# EAGLE design capsense-soil-sensor (EAGLE 7.4.0)
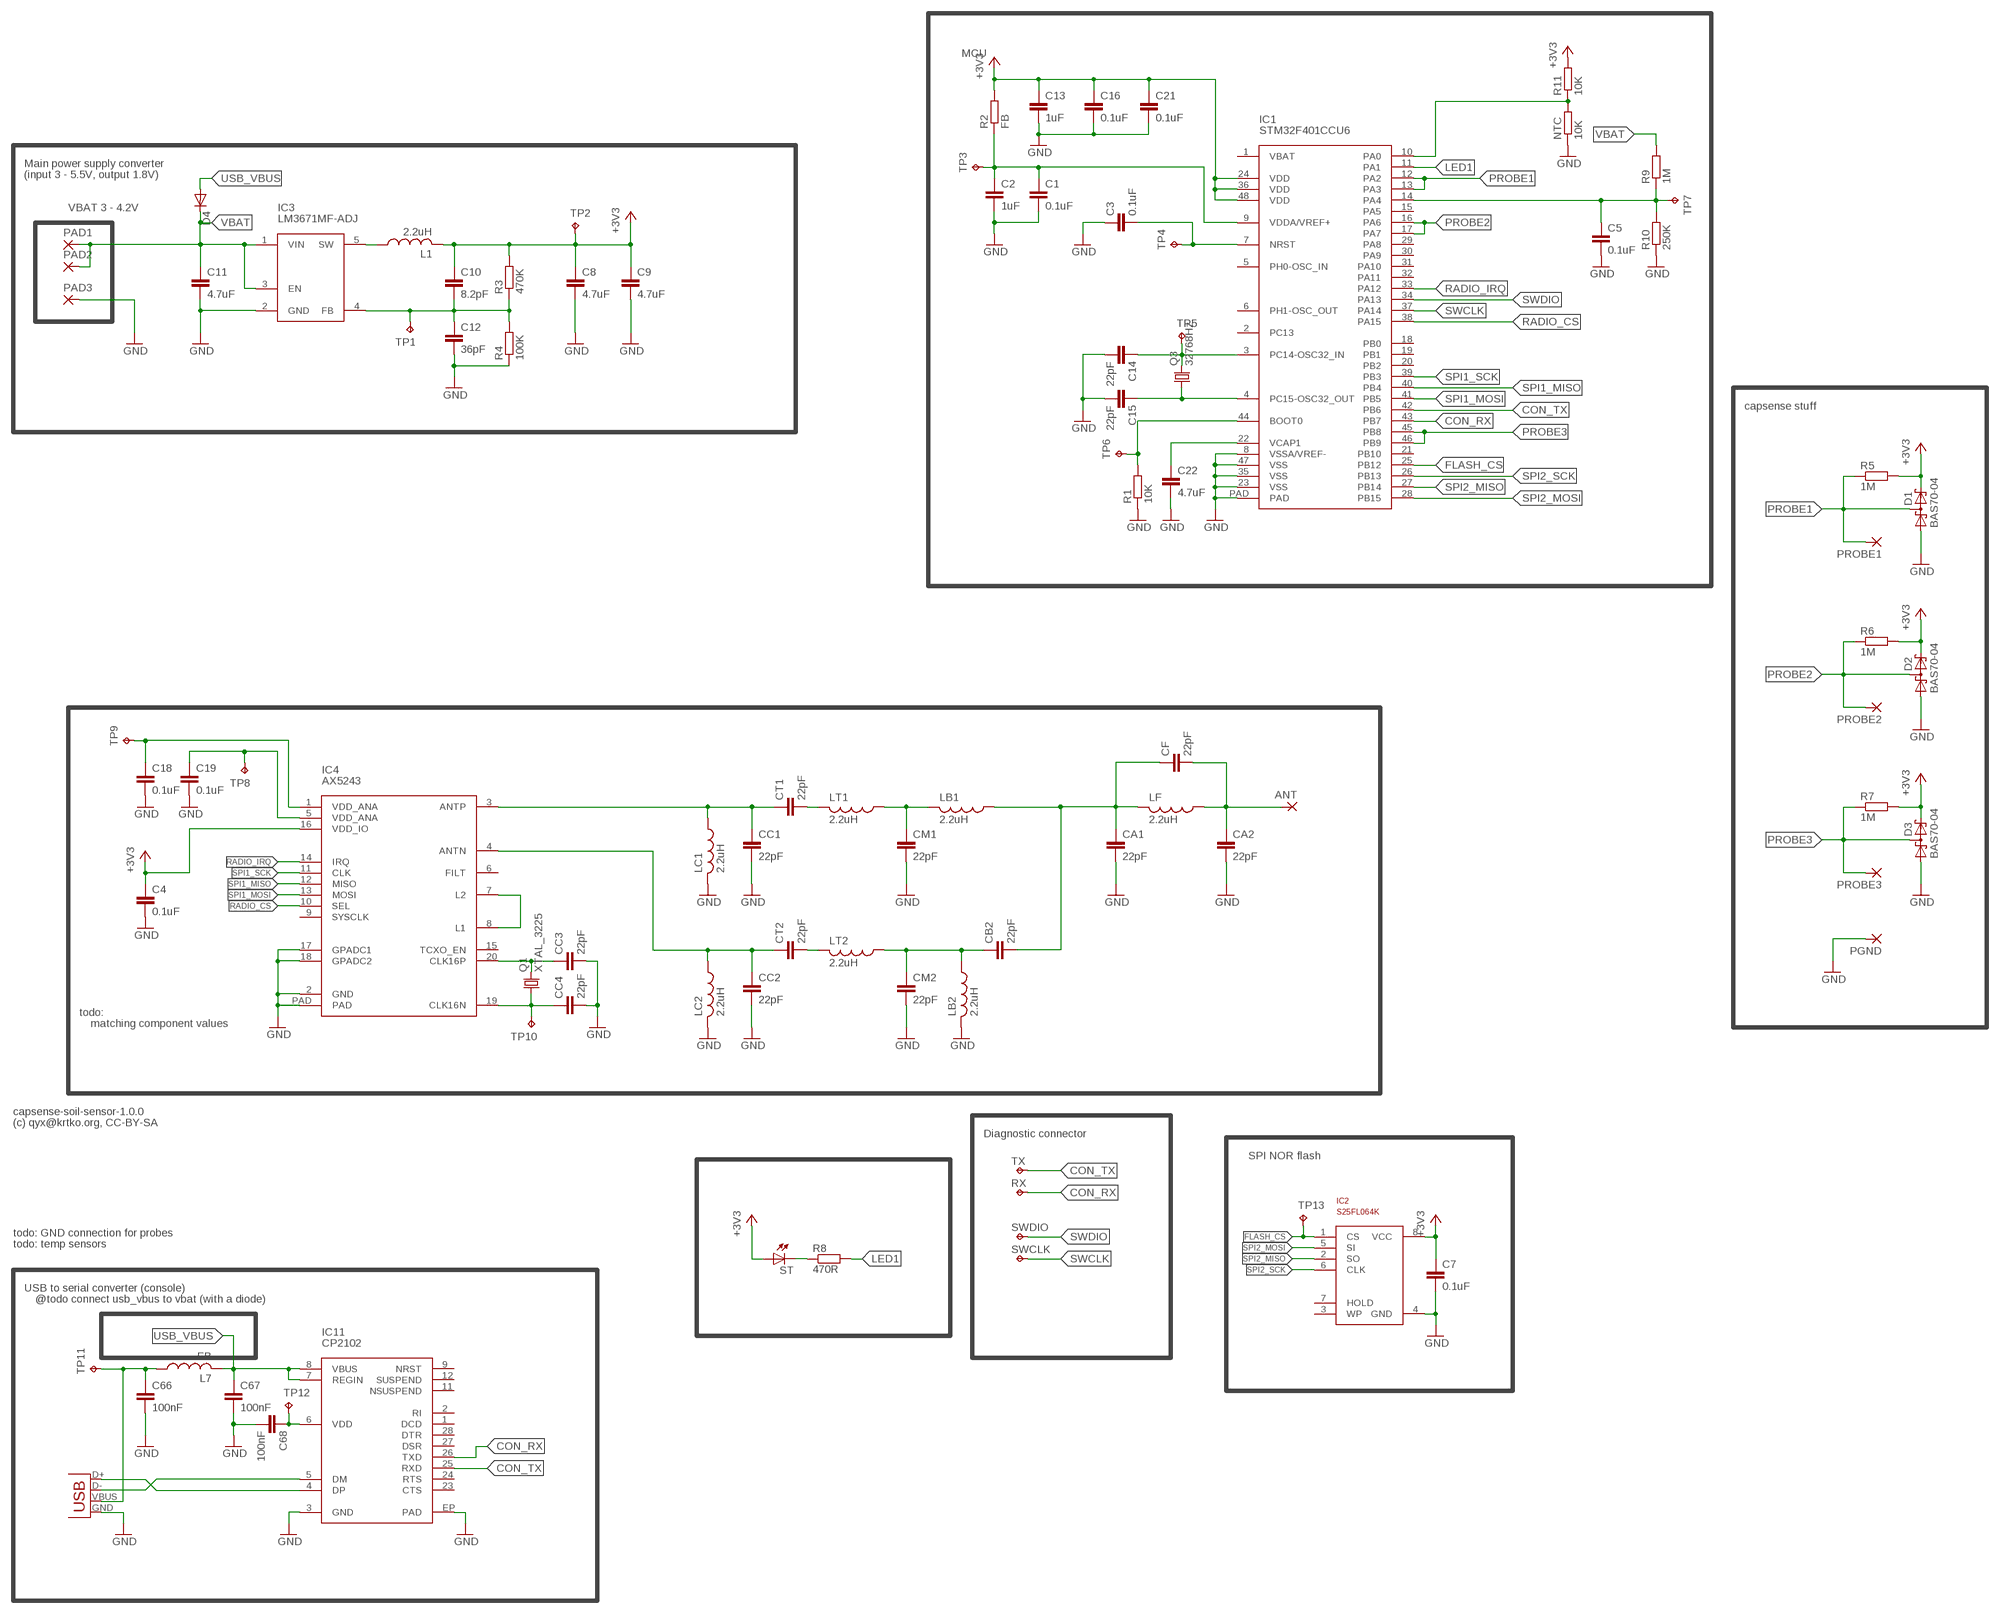
[diagram p0: schematic, sheet 1]

## Parts
ANT  2,15/1,0  [2,15/1,0]
C1  0.1uF  C-EUC0603  [C0603]
C2  1uF  C-EUC0603  [C0603]
C3  0.1uF  C-EUC0603  [C0603]
C4  0.1uF  C-EUC0603  [C0603]
C5  0.1uF  C-EUC0603  [C0603]
C7  0.1uF  C-EUC0603  [C0603]
C8  4.7uF  C-EUC0805  [C0805]
C9  4.7uF  C-EUC0805  [C0805]
C10  8.2pF  C-EUC0603  [C0603]
C11  4.7uF  C-EUC0805  [C0805]
C12  36pF  C-EUC0603  [C0603]
C13  1uF  C-EUC0603  [C0603]
C14  22pF  C-EUC0603  [C0603]
C15  22pF  C-EUC0603  [C0603]
C16  0.1uF  C-EUC0603  [C0603]
C18  0.1uF  C-EUC0603  [C0603]
C19  0.1uF  C-EUC0603  [C0603]
C21  0.1uF  C-EUC0603  [C0603]
C22  4.7uF  C-EUC0603  [C0603]
C66  100nF  C-EUC0603  [C0603]
C67  100nF  C-EUC0603  [C0603]
C68  100nF  C-EUC0603  [C0603]
CA1  22pF  C-EUC0603  [C0603]
CA2  22pF  C-EUC0603  [C0603]
CB2  22pF  C-EUC0603  [C0603]
CC1  22pF  C-EUC0603  [C0603]
CC2  22pF  C-EUC0603  [C0603]
CC3  22pF  C-EUC0603  [C0603]
CC4  22pF  C-EUC0603  [C0603]
CF  22pF  C-EUC0603  [C0603]
CM1  22pF  C-EUC0603  [C0603]
CM2  22pF  C-EUC0603  [C0603]
CT1  22pF  C-EUC0603  [C0603]
CT2  22pF  C-EUC0603  [C0603]
D1  BAS70-04  [SOT23]
D2  BAS70-04  [SOT23]
D3  BAS70-04  [SOT23]
D4  DIODE-SOD110-R  [SOD110-R]
IC1  STM32F401CCU6  [UFQFPN48]
IC2  S25FL064K  [SO-08M]
IC3  LM3671MF-ADJ  LM3671MF  [SOT23-5]
IC4  AX5243  [QFN20]
IC11  CP2102  [QFN28]
L1  2.2uH  L-USL2825P  [L2825P]
L7  FB  L-USL2012C  [L2012C]
LB1  2.2uH  L-USL2012C  [L2012C]
LB2  2.2uH  L-USL2012C  [L2012C]
LC1  2.2uH  L-USL2012C  [L2012C]
LC2  2.2uH  L-USL2012C  [L2012C]
LF  2.2uH  L-USL2012C  [L2012C]
LT1  2.2uH  L-USL2012C  [L2012C]
LT2  2.2uH  L-USL2012C  [L2012C]
NTC  10K  R-EU_R0603  [R0603]
PAD1  SMD5  [SMD2,54-5,08]
PAD2  SMD5  [SMD2,54-5,08]
PAD3  2,15/1,0  [2,15/1,0]
PGND  2,15/1,0  [2,15/1,0]
PROBE1  2,15/1,0  [2,15/1,0]
PROBE2  2,15/1,0  [2,15/1,0]
PROBE3  2,15/1,0  [2,15/1,0]
Q1  XTAL_3225  [XTAL_3225]
Q3  32768Hz  CRYSTALTC26H  [TC26H]
R1  10K  R-EU_R0603  [R0603]
R2  FB  R-EU_R0603  [R0603]
R3  470K  R-EU_R0603  [R0603]
R4  100K  R-EU_R0603  [R0603]
R5  1M  R-EU_R0603  [R0603]
R6  1M  R-EU_R0603  [R0603]
R7  1M  R-EU_R0603  [R0603]
R8  470R  R-EU_R0603  [R0603]
R9  1M  R-EU_R0603  [R0603]
R10  250K  R-EU_R0603  [R0603]
R11  10K  R-EU_R0603  [R0603]
RX  TPB2,54  [B2,54]
ST  LEDCHIPLED_0603  [CHIPLED_0603]
SWCLK  TPB2,54  [B2,54]
SWDIO  TPB2,54  [B2,54]
TP1  TPB1,27  [B1,27]
TP2  TPB1,27  [B1,27]
TP3  TPB1,27  [B1,27]
TP4  TPB1,27  [B1,27]
TP5  TPB1,27  [B1,27]
TP6  TPB1,27  [B1,27]
TP7  TPB1,27  [B1,27]
TP8  TPB1,27  [B1,27]
TP9  TPB1,27  [B1,27]
TP10  TPB1,27  [B1,27]
TP11  TPB1,27  [B1,27]
TP12  TPB1,27  [B1,27]
TP13  TPB1,27  [B1,27]
TX  TPB2,54  [B2,54]
X5  USB-MICROB  [USB-MICROB]

## Nets
+3V3: C4.1 C7.1 C8.1 C9.1 C10.1 C13.1 C16.1 C21.1 D1.2(C2) D2.2(C2) D3.2(C2) IC1.24(VDD) IC1.36(VDD) IC1.48(VDD) IC2.8(VCC) IC4.16(VDD_IO) L1.2 R2.2 R3.2 R5.2 R6.2 R7.2 R11.2 ST.A TP2.TP
CON_RX: IC1.43(PB7) IC11.26(TXD) RX.TP
CON_TX: IC1.42(PB6) IC11.25(RXD) TX.TP
FLASH_CS: IC1.25(PB12) IC2.1(CS) TP13.TP
GND: C1.2 C2.2 C3.1 C4.2 C5.2 C7.2 C8.2 C9.2 C11.2 C12.2 C13.2 C14.2 C15.2 C16.2 C18.2 C19.2 C21.2 C22.2 C66.2 C67.2 C68.2 CA1.2 CA2.2 CC1.2 CC2.2 CC3.2 CC4.2 CM1.2 CM2.2 D1.1(A1) D2.1(A1) D3.1(A1) IC1.8(VSSA/VREF-) IC1.23(VSS) IC1.35(VSS) IC1.47(VSS) IC1.PAD IC2.4(GND) IC3.2(GND) IC4.2(GND) IC4.17(GPADC1) IC4.18(GPADC2) IC4.PAD IC11.3(GND) IC11.EP(PAD) LB2.2 LC1.2 LC2.2 NTC.1 PAD3.1(P) PGND.1(P) R1.1 R4.1 R10.1 X5.GND
LED1: IC1.11(PA1) R8.2
N$1: IC1.44(BOOT0) R1.2 TP6.TP
N$2: C1.1 C2.1 IC1.9(VDDA/VREF+) R2.1 TP3.TP
N$3: IC3.5(SW) L1.1
N$4: CC3.1 IC4.20(CLK16P) Q1.3
N$5: C22.1 IC1.22(VCAP1)
N$6: C3.2 IC1.7(NRST) TP4.TP
N$7: C10.2 C12.1 IC3.4(FB) R3.1 R4.2 TP1.TP
N$8: C5.1 IC1.14(PA4) R9.1 R10.2 TP7.TP
N$9: IC1.10(PA0) NTC.2 R11.1
N$10: CC1.1 CT1.1 IC4.3(ANTP) LC1.1
N$11: CC2.1 CT2.1 IC4.4(ANTN) LC2.1
N$12: IC4.7(L2) IC4.8(L1)
N$13: CA1.1 CB2.2 CF.1 LB1.1 LF.2
N$14: ANT.1(P) CA2.1 CF.2 LF.1
N$15: CT1.2 LT1.2
N$16: CM1.1 LB1.2 LT1.1
N$17: CT2.2 LT2.2
N$18: CB2.1 CM2.1 LB2.1 LT2.1
N$19: C18.1 IC4.1(VDD_ANA) TP9.TP
N$20: CC4.1 IC4.19(CLK16N) Q1.1 TP10.TP
N$21: C14.1 IC1.3(PC14-OSC32_IN) Q3.2 TP5.TP
N$22: C19.1 IC4.5(VDD_ANA) TP8.TP
N$23: R8.1 ST.C
N$24: C15.1 IC1.4(PC15-OSC32_OUT) Q3.1
N$33: IC11.4(DP) X5.D+
N$34: IC11.5(DM) X5.D-
N$67: C66.1 L7.1 TP11.TP X5.VBUS
N$68: C68.1 IC11.6(VDD) TP12.TP
PROBE1: D1.3(C1A2) IC1.12(PA2) IC1.13(PA3) PROBE1.1(P) R5.1
PROBE2: D2.3(C1A2) IC1.16(PA6) IC1.17(PA7) PROBE2.1(P) R6.1
PROBE3: D3.3(C1A2) IC1.45(PB8) IC1.46(PB9) PROBE3.1(P) R7.1
RADIO_CS: IC1.38(PA15) IC4.10(SEL)
RADIO_IRQ: IC1.33(PA12) IC4.14(IRQ)
SPI1_MISO: IC1.40(PB4) IC4.12(MISO)
SPI1_MOSI: IC1.41(PB5) IC4.13(MOSI)
SPI1_SCK: IC1.39(PB3) IC4.11(CLK)
SPI2_MISO: IC1.27(PB14) IC2.2(SO)
SPI2_MOSI: IC1.28(PB15) IC2.5(SI)
SPI2_SCK: IC1.26(PB13) IC2.6(CLK)
SWCLK: IC1.37(PA14) SWCLK.TP
SWDIO: IC1.34(PA13) SWDIO.TP
USB_VBUS: C67.1 D4.A IC11.7(REGIN) IC11.8(VBUS) L7.2
VBAT: C11.1 D4.C IC3.1(VIN) IC3.3(EN) PAD1.1(P) PAD2.1(P) R9.2
Unconnected: IC1.1(VBAT) IC1.2(PC13) IC1.5(PH0-OSC_IN) IC1.6(PH1-OSC_OUT) IC1.15(PA5) IC1.18(PB0) IC1.19(PB1) IC1.20(PB2) IC1.21(PB10) IC1.29(PA8) IC1.30(PA9) IC1.31(PA10) IC1.32(PA11) IC2.3(WP) IC2.7(HOLD) IC4.6(FILT) IC4.9(SYSCLK) IC4.15(TCXO_EN) IC11.1(DCD) IC11.2(RI) IC11.9(NRST) IC11.11(NSUSPEND) IC11.12(SUSPEND) IC11.23(CTS) IC11.24(RTS) IC11.27(DSR) IC11.28(DTR)

## Notes on the sheet
- MCU
- Main power supply converter
- (input 3 - 5.5V, output 1.8V)
- VBAT 3 - 4.2V
- capsense stuff
- todo:
- matching component values
- capsense-soil-sensor-1.0.0
- (c) qyx@krtko.org, CC-BY-SA
- Diagnostic connector
- SPI NOR flash
- todo: GND connection for probes
- todo: temp sensors
- USB to serial converter (console)
- @todo connect usb_vbus to vbat (with a diode)

## Library data of the parts
ANT PAD3 PGND PROBE1-PROBE3 = wirepad:2,15/1,0: THROUGH-HOLE PAD
C1-C5 C7-C16 C18 C19 C21 C22 C66-C68 CA1 CA2 CB2 CC1-CC4 CF CM1 CM2 CT1 CT2 = rcl:C-EU: CAPACITOR, European symbol
D1-D3 = diode:BAS70-04: Silicon Schottky Diodes General-purpose diode for high-speed switching
D4 = diode:DIODE-: DIODE
IC1 = qyx-misc:STM32F401CCU6
IC2 = qyx-misc:S25FL064K
IC3 = qyx-misc:LM3671
IC4 = radio_transceivers:AX5243
IC11 = usb-serial:CP2102
L1 L7 LB1 LB2 LC1 LC2 LF LT1 LT2 = rcl:L-US: INDUCTOR, American symbol
NTC R1-R11 = rcl:R-EU_: RESISTOR, European symbol
PAD1 PAD2 = wirepad:SMD5: SMD PAD
Q1 = crystals:XTAL_3225
Q3 = crystal:CRYSTAL: CRYSTAL; OC_FARNELL: unknown; OC_NEWARK: unknown
RX SWCLK SWDIO TP1-TP13 TX = testpad:TP: Test pad
ST = led:LED: LED OSRAM: - CHIPLED LG R971, LG N971, LY N971, LG Q971, LY Q971, LO R971, LY R971 LH N974, LH R974 LS Q976, LO Q976, LY Q976 LO Q996 - Hyper CHIPLED LW Q18S LB Q993, LB Q99A, LB R99A - SideLED LS A670, LO A670, LY A670, LG A670, LP A670 LB A673, LV A673, LT A673, LW A673 LH A674 LY A675 LS A676, LA A676, LO A676, LY A676, LW A676 LS A679, LY A679, LG A679 - Hyper Micro SIDELED® LS Y876, LA Y876, LO Y876, LY Y876 LT Y87S - SmartLED LW L88C, LW L88S LB L89C, LB L89S, LG L890 LS L89K, LO L89K, LY L89K LS L896, LA L896, LO L896, LY L896 - TOPLED LS T670, LO T670, LY T670, LG T670, LP T670 LSG T670, LSP T670, LSY T670, LOP T670, LYG T670 LG T671, LOG T671, LSG T671 LB T673, LV T673, LT T673, LW T673 LH T674 LS T676, LA T676, LO T676, LY T676, LB T676, LH T676, LSB T676, LW T676 LB T67C, LV T67C, LT T67C, LS T67K, LO T67K, LY T67K, LW E67C LS E67B, LA E67B, LO E67B, LY E67B, LB E67C, LV E67C, LT E67C LW T67C LS T679, LY T679, LG T679 LS T770, LO T770, LY T770, LG T770, LP T770 LB T773, LV T773, LT T773, LW T773 LH T774 LS E675, LA E675, LY E675, LS T675 LS T776, LA T776, LO T776, LY T776, LB T776 LHGB T686 LT T68C, LB T68C - Hyper Mini TOPLED® LB M676 - Mini TOPLED Santana® LG M470 LS M47K, LO M47K, LY M47K Source: http://www.osram.convergy.de LUXEON: - LUMILED® LXK2-PW12-R00, LXK2-PW12-S00, LXK2-PW14-U00, LXK2-PW14-V00 LXK2-PM12-R00, LXK2-PM12-S00, LXK2-PM14-U00 LXK2-PE12-Q00, LXK2-PE12-R00, LXK2-PE12-S00, LXK2-PE14-T00, LXK2-PE14-U00 LXK2-PB12-K00, LXK2-PB12-L00, LXK2-PB12-M00, LXK2-PB14-N00, LXK2-PB14-P00, LXK2-PB14-Q00 LXK2-PR12-L00, LXK2-PR12-M00, LXK2-PR14-Q00, LXK2-PR14-R00 LXK2-PD12-Q00, LXK2-PD12-R00, LXK2-PD12-S00 LXK2-PH12-R00, LXK2-PH12-S00 LXK2-PL12-P00, LXK2-PL12-Q00, LXK2-PL12-R00 Source: www.luxeon.com KINGBRIGHT: KA-3528ASYC Source: www.kingbright.com
X5 = SparkFun:USB: USB Connectors USB-B-PTH is fully proven SKU : PRT-00139 USB-miniB is fully proven SKU : PRT-00587 USB-A-PCB is untested. USB-A-H is throughly reviewed, but untested. Spark Fun Electronics SKU : PRT-00437 USB-B-SMT is throughly reviewed, but untested. Needs silkscreen touching up. USB-A-S has not been used/tested USB-MB-H has not been used/tested

## Board
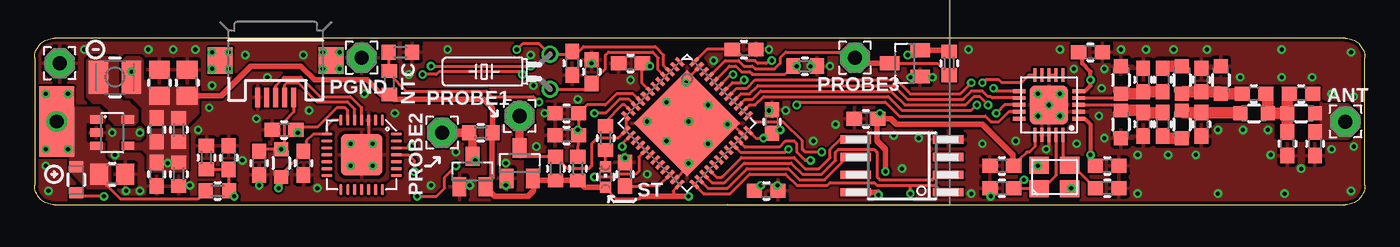
[diagram p1: board, top side]
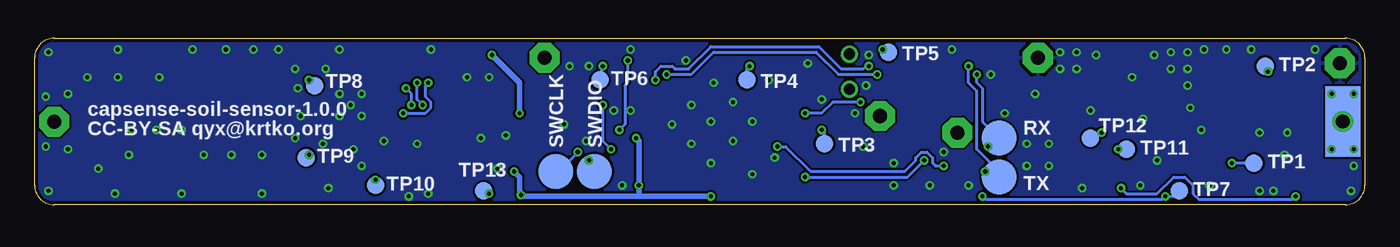
[diagram p2: board, bottom side, seen from below]

Size 96 x 12 mm. Coordinates in mm from the lower left corner, seen from the top.
Outline: 1.4,0 94.6,0 arc90 96,1.4 96,10.6 arc90 94.6,12 1.4,12 arc90 0,10.6 0,1.4 arc90 1.4,0
Copper layers (1*16): Top 0.035mm / dielectric 1.5mm / Bottom 0.035mm
Design rules "seeed": minimum track width 6mil, minimum drill 0.3mm, track to track 6mil, track to pad 6mil, pad to pad 6mil, via to via 6mil, smd to smd 0mil, copper to edge 10mil, drill to drill 10mil, minimum pad ring 6mil, minimum via ring 6mil, stop-mask expansion 2mil, vias tented up to drill 0.5mm, thermal gap 10mil
tRestrict: area 78.2,4.2 to 92.6,10.6; 15 lines

### Footprints (pad centres in the part's own frame; a part is rotated, then mirrored left to right if it is on the bottom)
2,15/1,0 = drill 1.016 pad 2.159 octagon: 1 0,0
C0603 = smd 1.1 x 1: 1 -0.85,0; 2 0.85,0
C0805 = smd 1.3 x 1.5: 1 -0.95,0; 2 0.95,0
SOT23 = smd 1 x 1.4: 1 -0.95,-1.1; 2 0.95,-1.1; 3 0,1.1
SOD110-R = smd 0.8 x 1: A 0.95,0; C -0.95,0
UFQFPN48 = smd 0.8 x 0.3: 1 -3.5,2.75; 2 -3.5,2.25; 3 -3.5,1.75; 4 -3.5,1.25; 5 -3.5,0.75; 6 -3.5,0.25; 7 -3.5,-0.25; 8 -3.5,-0.75; 9 -3.5,-1.25; 10 -3.5,-1.75; 11 -3.5,-2.25; 12 -3.5,-2.75; 25 3.5,-2.75; 26 3.5,-2.25; 27 3.5,-1.75; 28 3.5,-1.25; 29 3.5,-0.75; 30 3.5,-0.25; 31 3.5,0.25; 32 3.5,0.75; 33 3.5,1.25; 34 3.5,1.75; 35 3.5,2.25; 36 3.5,2.75 | smd 0.3 x 0.8: 13 -2.75,-3.5; 14 -2.25,-3.5; 15 -1.75,-3.5; 16 -1.25,-3.5; 17 -0.75,-3.5; 18 -0.25,-3.5; 19 0.25,-3.5; 20 0.75,-3.5; 21 1.25,-3.5; 22 1.75,-3.5; 23 2.25,-3.5; 24 2.75,-3.5; 37 2.75,3.5; 38 2.25,3.5; 39 1.75,3.5; 40 1.25,3.5; 41 0.75,3.5; 42 0.25,3.5; 43 -0.25,3.5; 44 -0.75,3.5; 45 -1.25,3.5; 46 -1.75,3.5; 47 -2.25,3.5; 48 -2.75,3.5 | smd 5.4 x 5.4: PAD 0,0
SO-08M = smd 0.6 x 2.2: 1 -1.905,-3.33; 2 -0.635,-3.33; 3 0.635,-3.33; 4 1.905,-3.33; 5 1.905,3.33; 6 0.635,3.33; 7 -0.635,3.33; 8 -1.905,3.33
SOT23-5 = smd 0.6 x 0.9: 1 -0.95,-1.15; 2 0,-1.15; 3 0.95,-1.15; 4 0.95,1.15; 5 -0.95,1.15
QFN20 = smd 1 x 0.3: 1 -2.15,1; 2 -2.15,0.5; 3 -2.15,0; 4 -2.15,-0.5; 5 -2.15,-1; 11 2.15,-1; 12 2.15,-0.5; 13 2.15,0; 14 2.15,0.5; 15 2.15,1 | smd 0.3 x 1: 6 -1,-2.15; 7 -0.5,-2.15; 8 0,-2.15; 9 0.5,-2.15; 10 1,-2.15; 16 1,2.15; 17 0.5,2.15; 18 0,2.15; 19 -0.5,2.15; 20 -1,2.15 | smd 2.8 x 2.8: PAD 0,0
QFN28 = smd 0.8 x 0.25: 1 -2.5,1.5; 2 -2.5,1; 3 -2.5,0.5; 4 -2.5,0; 5 -2.5,-0.5; 6 -2.5,-1; 7 -2.5,-1.5; 15 2.5,-1.5; 16 2.5,-1; 17 2.5,-0.5; 18 2.5,0; 19 2.5,0.5; 20 2.5,1; 21 2.5,1.5 | smd 0.25 x 0.8: 8 -1.5,-2.5; 9 -1,-2.5; 10 -0.5,-2.5; 11 0,-2.5; 12 0.5,-2.5; 13 1,-2.5; 14 1.5,-2.5; 22 1.5,2.5; 23 1,2.5; 24 0.5,2.5; 25 0,2.5; 26 -0.5,2.5; 27 -1,2.5; 28 -1.5,2.5 | smd 3 x 3: EP 0,0
L2825P = smd 1.4 x 2.4: 1 -1.2,0; 2 1.2,0
L2012C = smd 1 x 1: 1 -1,0; 2 1,0
R0603 = smd 1 x 1.1: 1 -0.85,0; 2 0.85,0
SMD2,54-5,08 = smd 2.54 x 5.08: 1 0,0
XTAL_3225 = smd 1.4 x 1.2: 1 -1.1,-0.85; 2 1.1,-0.85; 3 1.1,0.85; 4 -1.1,0.85
TC26H = drill 0.813: 1 -1.27,0; 2 1.27,0
B2,54 = smd 2.54 x 2.54: TP 0,0
CHIPLED_0603 = smd 0.8 x 0.8: A 0,-0.75; C 0,0.75
B1,27 = smd 1.27 x 1.27: TP 0,0
USB-MICROB = smd 0.35 x 1.4: D+ 0,2.65; D- -0.65,2.65; GND 1.3,2.65; ID 0.65,2.65; VBUS -1.3,2.65 | smd 1.8 x 1.9: MT1 -4,0; MT2 4,0

### Placement (x,y rotation side)
ANT  94.6,6 0 top
C1  38.4,6.6 180 top
C2  38.4,5 180 top
C3  43,10.2 0 top
C4  69.8,2.8 180 top
C5  14,3.4 90 top
C7  52.8,1 0 top
C8  11,8.8 90 top
C9  9,8.8 90 top
C10  8.8,5.4 270 top
C11  5.6,2.2 0 top
C12  8.8,2.2 270 top
C13  60,6.2 180 top
C14  38.8,10.2 270 top
C15  40.2,9.6 90 top
C16  53.2,6 90 top
C18  77.4,2.8 0 top
C19  76.2,11 0 top
C21  51.2,11.2 0 top
C22  42.6,2.2 90 top
C66  16.2,3 270 top
C67  19.4,3 270 top
C68  18,5.4 180 top
CA1  90.4,4.4 270 top
CA2  92.4,4.4 270 top
CB2  88,8 0 top
CC1  80,5.8 270 top
CC2  80,9 90 top
CC3  77.4,1.2 0 top
CC4  69.8,1.2 180 top
CF  91.4,8 0 top
CM1  84.2,5.8 270 top
CM2  84.2,9 90 top
CT1  81.4,5.8 270 top
CT2  81.4,9 90 top
D1  35,3 0 top
D2  31.6,2.4 0 top
D3  62.8,10.2 90 top
D4  3,1.8 270 top
IC1  47.08,5.88 315 top
IC2  62.6,2.8 90 top
IC3  5.6,5.2 270 top
IC4  73.2,7.2 180 top
IC11  23.6,3.6 270 top
L1  5.8,9.2 0 top
L7  17.8,3 270 top
LB1  88,6.6 180 top
LB2  85.6,9 90 top
LC1  78.4,5.8 270 top
LC2  78.4,9 90 top
LF  91.4,6.6 180 top
LT1  82.8,5.8 270 top
LT2  82.8,9 90 top
NTC  26.4,11 180 top
PAD1  1.6,6 0 top
PAD2  1.6,6 0 bottom
PAD3  1.8,10.2 0 top
PGND  23.6,10.6 0 top
PROBE1  35,6.4 0 top
PROBE2  29.4,5.2 0 top
PROBE3  59.2,10.6 0 top
Q1  73.6,2 0 top
Q3  37.2,9.6 90 top
R1  55.6,10 180 top
R2  39.2,2.6 270 top
R3  10.4,5.4 90 top
R4  10.4,2.2 90 top
R5  37.6,2.6 270 top
R6  32.2,5.2 0 top
R7  66,10.2 90 top
R8  41.2,4.8 90 top
R9  13.2,1 180 top
R10  12.4,3.4 270 top
R11  25.6,8.8 270 top
RX  26.4,4.8 0 bottom
ST  41.2,2 0 top
SWCLK  58.4,2.4 0 bottom
SWDIO  55.6,2.4 0 bottom
TP1  8,3 0 bottom
TP2  7.2,10 0 bottom
TP3  39,4.4 0 bottom
TP4  44.6,9 0 bottom
TP5  34.4,11 0 bottom
TP6  55.2,9 0 bottom
TP7  13.4,1 0 bottom
TP8  75.8,8.6 0 bottom
TP9  76.4,3.4 0 bottom
TP10  71.4,1.4 0 bottom
TP11  17.2,4 0 bottom
TP12  19.8,4.8 0 bottom
TP13  63.6,1 0 bottom
TX  26.4,2 0 bottom
X5  17.4,10.4 180 top

### Tracks (layer width: path | path; a pad name or v marks a point on that pad's centre or on a via)
+3V3  (via drill 0.3)
  Top 0.2: 10.8,6 10.65,6 R3.2 | IC1.24 46.09,1 46.09,0.71 46.2,0.6 | ST.A 41.2,1.2 42,0.4 43.6,0.4 43.8,0.6 | IC1.36 52.05,4.8 52.85,4.8 C16.1 53.55,5.15 v53.8,5.4 | IC1.48 48.51,11.2 C21.1 50.55,11 50.8,11 51.4,10.4 52,10.4 52.2,10.2 52.8,10.2 53,10.4 v53.2,10.4 | IC4.16 72.2,4.2 71.8,3.8 71.6,3.8 71,3.2 71,3.15 C4.1 | L1.2 v7,9.6
  Top 0.406: C8.1 13.45,7.85 15.6,10 19.2,10 20.2,9 24,9 25.05,7.95 R11.2 25.95,7.6 32.4,7.6 33.05,6.95 R6.2 33,5.15 33,2 32.55,1.55 D2.2 | D2.2 32.55,1.25 33.2,0.6 35.6,0.6 36,1 36,1.85 D1.2 36.1,1.75 R5.2 R2.2 | ST.A 39.7,1.25 R2.2 | D2.2 32.5,1.3 | 39,1.55 R2.2 | 43.8,0.6 46.2,0.6 v47.2,0.6 | v52.4,1.4 52.35,1.4 C7.1 | v52.6,4.8 C16.1 | IC2.8 60.9,0.9 v60.9,0.7 | v61.4,2.4 61.4,4 60.8,4.6 60.8,6.15 C13.1 | R7.2 65.9,11.15 D3.2 63.55,10.8 v63,10.8 | C13.1 60.85,6.45 v61,6.6 | C13.1 61.8,6.2 62.2,5.8 68.4,5.8 70.6,3.6 70.6,2.85 C4.1
  Bottom 0.2: v53.2,10.4 53.2,8.8 53.4,8.6 53.4,5.8 v53.8,5.4 | v7,9.6 7,9.8 TP2.TP
  Bottom 0.406: v47.2,0.6 52.4,0.6 | 52.4,0.6 v52.4,1.4 52.4,4.6 v52.6,4.8 | 52.4,0.6 60.8,0.6 v60.9,0.7 61,1 61,2 v61.4,2.4 | v61,6.6 61,8.8 v63,10.8
  pour Top (no thermals): 8.4,5.8 11,5.8 11.8,6.6 11.8,8.4 8.4,8.4 7.8,9 7.8,10.4 7.6,10.6 6.6,10.6 6.4,10.4 6.4,8 6.6,7.8 7,7.8 7.8,7 7.8,6 8,5.8
CON_RX  (via drill 0.3)
  Top 0.2: IC11.26 27.1,4.1 v27.2,4.2 | IC1.43 50.25,9.4 v50.4,9.4 | v35.2,9.4 35,9.6 29.2,9.6 29,9.4 v28,9.4
  Bottom 0.2: v50.4,9.4 48.6,9.4 47,11 39.6,11 38,9.4 v35.2,9.4 | v27.2,4.2 26.6,4.8 RX.TP 27.6,6 27.6,8.4 28,8.8 v28,9.4
CON_TX  (via drill 0.3)
  Top 0.2: IC1.42 50.35,8.8 51,8.8 v51.2,9 | IC11.25 27,3.6 27.4,3.2 v27.4,2.4 | v28.6,10 v35.8,10
  Bottom 0.2: v51.2,9 51.2,9.6 50.8,10 50,10 49.8,9.8 48.8,9.8 47.2,11.4 39.4,11.4 37.8,9.8 36.2,9.8 36,10 v35.8,10 | v27.4,2.4 26.8,2.4 | 26.8,2.4 TX.TP | v28.6,10 28.6,8.8 28,8.2 28,4 27,3 27,2.6 26.8,2.4
FLASH_CS  (via drill 0.3)
  Top 0.2: IC1.25 48.28,0.8 50.2,0.8 51.6,2.2 54.2,2.2 55,1.4 57.2,1.4 57.4,1.6 60.6,1.6 60.8,1.4 63.2,1.4 | 63.2,1.4 65,1.4 65.4,1 65.83,1 IC2.1 | v63.2,0.8 63.2,1.4
  Bottom 0.2: TP13.TP 63.4,1 v63.2,0.8
GND  (via drill 0.3)
  Top 0.2: v22.8,4.4 IC11.EP 24.1,4.1 IC11.3 | IC1.23 47.2,2.82 v47.2,3 | IC1.35 50.35,5.8 v50,5.8 | IC1.47 47,8.98 v47,8.8 | IC4.18 73.2,4.2 v73,4
  Top 0.406: v42.6,3.4 C22.2
  other vias: 16,6.2 15,3.2 19.8,6.8 20.4,1.2 16.2,1.4 24.4,2.8 28.6,1.4 22.8,2.8 24.4,4.4 5.6,5.2 7.6,5.2 7.6,1 11.2,1.4 6.6,1 1,1 0.8,2.8 3.6,11.2 8.2,11.2 10,11.2 11.6,11.2 5.8,3.6 16.8,9.2 12.6,7 11.8,5.4 12.8,8.6 15.2,10.8 19.4,10.8 26,6.6 27,9.4 23.8,8 12.8,11 14,11 12.8,9.8 14,9.8 20.8,11 22,11 22,9.8 20.8,9.8 44.2,6 45.6,7.4 48.6,7.2 47.2,6 48.6,4.4 43,9 34,1.4 34,3 31.4,1.4 30.4,3.8 36.2,4.2 36.8,6.6 39.2,7.6 44.2,2.2 53.6,1.4 49,10.4 53,11.2 54.2,6.8 56.2,4.6 57.8,5.8 62.6,2.6 69,0.6 68.4,4.4 63.8,4.8 56,10 57.4,10 53,6.8 72.4,6.4 72.4,8 74,8 74,6.4 73.2,7.2 76.8,6.4 77.2,4.8 79.6,3.6 81.8,3.6 83.8,3.6 85.4,5.4 87.2,5.4 89,5.4 89.2,3.6 91.4,2.6 93.6,4 95.2,4.2 95.2,7.8 93.6,8 92.2,9.2 90,9.2 87,9.2 78.4,11.2 80.2,11.2 82.2,11.2 84.6,11.2 77,8.4 77.2,9.8 72.4,2.8 74.8,1.2 79.6,0.8 85.4,0.8 95,1 90.2,0.8 95,11 90,11.2 67.6,0.8 74,11.2 67.4,11.2 62,5 35.8,10.8 29.8,11.2 75.2,4.4 75,9.8 70.8,4.6 64.8,9.2 63.2,9.2 40.2,10.2 45.6,4.6 36,8.6
  pour Top (rank 2): 0,0 96,0 96,12 0,12
  pour Bottom (rank 2): 0,0 96,0 96,12 0,12
LED1
  Top 0.2: IC1.11 42.58,7.2 42.4,7.2 41.2,6 R8.2
N$1  (via drill 0.3)
  Top 0.2: IC1.44 50.14,10 50.6,10 51,9.6 51.6,9.6 51.8,9.4 54.15,9.4 R1.2 54.95,9.8 v55,10
  Bottom 0.2: TP6.TP v55,10
N$2  (via drill 0.3)
  Top 0.2: IC1.9 43.2,8 42,8 41.2,7.2 39.85,7.2 C1.1 C2.1 | R2.1 C2.1 | v39.2,5.4 38.85,5.4 C2.1
  Bottom 0.2: TP3.TP 39,5.2 v39.2,5.4
N$3
  pour Top (no thermals): 6.4,5.8 7.2,5.8 7.4,6 7.4,6.8 6.8,7.4 6.4,7.4 6,7.8 6,10.4 5.8,10.6 4,10.6 3.8,10.4 3.8,7.8 4.2,7.4 4.8,7.4 5.4,6.8 5.4,6.2 5.8,5.8
N$4
  Top 0.2: IC4.20 74.2,3.35 Q1.3 74.9,2.85 CC3.1
N$5
  Top 0.2: C22.1 43.55,1.35 43.6,1.4 45.08,1.4 IC1.22
N$6  (via drill 0.3)
  Top 0.2: IC1.7 43.85,8.76 C3.2 44.05,10 v44.4,10
  Bottom 0.2: TP4.TP 44.6,9.8 v44.4,10
N$7  (via drill 0.3)
  Top 0.2: v9.6,3 10.35,3 R4.2
  Bottom 0.2: TP1.TP v9.6,3
  pour Top (no thermals): 8.2,5.4 10.6,5.4 11,5 11,2.6 10.8,2.4 8.4,2.4 8.2,2.6 8.2,3.6 7.8,4 6.4,4 6.4,4.4 7.8,4.4 8.2,4.8
N$8  (via drill 0.3)
  Top 0.2: IC1.14 42.4,4.38 v42.4,4.2 | v14.4,0.6 14.4,0.65 R9.1 14,1.05 C5.1 R10.2 | v27.6,0.6 29,0.6 29.6,1.2 29.6,2 v30.4,2.8
  Bottom 0.2: v27.6,0.6 27.4,0.4 14.6,0.4 v14.4,0.6 13.8,0.6 TP7.TP | v42.4,4.2 41.8,4.2 40,2.4 33.2,2.4 32.4,3.2 32.4,3.4 32,3.8 31.6,3.8 31.2,3.4 31.2,3 31,2.8 v30.4,2.8
N$9  (via drill 0.3)
  Top 0.2: NTC.2 25.55,9.7 R11.1 25.6,9.4 26.8,8.2 32.6,8.2 33,7.8 36,7.8 v36.4,7.4 | IC1.10 42.89,7.6 42.2,7.6 41.2,6.6 v40.4,6.6
  Bottom 0.2: v36.4,7.4 38.4,7.4 39.2,6.6 v40.4,6.6
N$10
  Top 0.2: IC4.3 78,7.2 LC1.1
  Top 0.813: LC1.1 79.85,6.8 CC1.1 CT1.1
N$11
  Top 0.2: IC4.4 78.1,7.7 LC2.1
  Top 0.813: LC2.1 79.85,8 CC2.1 CT2.1
N$12
  Top 0.305: IC4.8 IC4.7
N$13
  Top 0.813: CB2.2 89,7.85 LB1.1 LF.2 | LF.2 90.4,7.85 CF.1 | LF.2 CA1.1
N$14
  pour Top (no thermals): 92,4.8 94.8,4.8 95.6,5.6 95.6,6.4 94.8,7.2 93,7.2 92.8,7.4 92.8,8.4 92,8.4
N$15
  Top 0.813: LT1.2 81.55,4.8 CT1.2
N$16
  Top 0.813: LT1.1 82.95,6.65 CM1.1 86.95,6.65 LB1.2
N$17
  Top 0.813: LT2.2 81.55,10 CT2.2
N$18
  Top 0.813: LT2.1 82.95,8.15 CM2.1 85.45,8.15 LB2.1 CB2.1
N$19  (via drill 0.3)
  Top 0.305: IC4.1 75.8,6.2 76.2,5.8 v76.2,3.6 76.2,3.15 C18.1
  Bottom 0.2: TP9.TP v76.2,3.6
N$20  (via drill 0.3)
  Top 0.2: IC4.19 73.7,2.1 73,1.4 72.75,1.4 Q1.1 70.7,1.15 CC4.1 71.25,1.8 v71.4,1.8
  Bottom 0.2: TP10.TP v71.4,1.8
N$21  (via drill 0.3)
  Top 0.2: IC1.3 45.4,10.04 45.4,10.8 44.8,11.4 39.6,11.4 39.25,11.05 C14.1 38.62,10.87 Q3.2 37.13,10.87 36.4,11.6 35.2,11.6 v34.8,11.2
  Bottom 0.2: v34.8,11.2 34.6,11.2 TP5.TP
N$22  (via drill 0.3)
  Top 0.305: IC4.5 75.8,8.2 76.2,8.6 v76.2,9 76.2,9.6 75.6,10.2 75.6,10.75 C19.1
  Bottom 0.2: TP8.TP v76.2,9
N$23
  Top 0.2: ST.C R8.1
N$24
  Top 0.2: Q3.1 39.78,8.33 C15.1 40.2,8.8 41.2,9.8 41.2,10.8 41.4,11 44.6,11 45,10.6 45,9.73 IC1.4
N$33
  Top 0.2: X5.D+ 17.4,8.6 18,9.2 19.2,9.2 20.6,7.8 22.8,7.8 23.6,7 IC11.4
N$34
  Top 0.2: IC11.5 23.1,6.9 22.6,7.4 20.4,7.4 19,8.8 18.2,8.8 18.05,8.65 X5.D-
N$67  (via drill 0.3)
  Top 0.2: X5.VBUS 18.7,6.7 18,6 18,4.2 L7.1 16.35,4 C66.1
  Bottom 0.2: TP11.TP L7.1
  other vias: 17.8,4
N$68  (via drill 0.3)
  Top 0.2: IC11.6 22.6,6.8 22.4,7 21.8,7 20.4,5.6 19.05,5.6 C68.1 19,5.25 v19,5.2
  Bottom 0.2: TP12.TP v19,5.2
PROBE1
  Top 0.2: IC1.12 IC1.13 42.11,4.8 40.6,4.8 40.2,4.4 40.2,2.8 40,2.6 38.45,2.6 R5.1 35.05,3.45 D1.3
  Top 0.61: PROBE1.1 D1.3
PROBE2  (via drill 0.3)
  Top 0.2: IC1.16 IC1.17 43.6,3.46 43.6,2.4 43.4,2.2 42,2.2 41.8,2 v40.4,2 | v31.8,3.2 31.9,3.2 D2.3
  Top 0.61: D2.3 31.6,4.95 R6.1 PROBE2.1
  Bottom 0.2: v40.4,2 33,2 v31.8,3.2
PROBE3
  Top 0.2: IC1.46 IC1.45 49.83,10.4 50.8,10.4 51.2,10 51.8,10 52,9.8 53.4,9.8 53.8,10.2 53.8,10.6 54.2,11 58.8,11 PROBE3.1 | D3.3 65.15,10.2 R7.1
  Top 0.406: D3.3 59.6,10.2 PROBE3.1
RADIO_CS  (via drill 0.3)
  Top 0.2: IC1.38 51.58,7.2 52,7.2 52.6,7.8 61.6,7.8 62.6,6.8 67.6,6.8 v68,7.2 | IC4.10 71.75,9.35 71.2,8.8 69.8,8.8 69.6,9 68.6,9 v68.4,8.8
  Bottom 0.2: v68,7.2 68.4,7.6 v68.4,8.8
RADIO_IRQ  (via drill 0.3)
  Top 0.2: IC1.33 50.93,3.8 54.2,3.8 v54.4,4 | v55,7.2 55.2,7.4 61.4,7.4 62.4,6.4 68.6,6.4 69,6 69.6,6 70.3,6.7 IC4.14
  Bottom 0.2: v55,7.2 55,4.6 v54.4,4
SPI1_MISO
  Top 0.2: IC1.40 50.97,8 51.6,8 52.2,8.6 62,8.6 63,7.6 67,7.6 67.6,8.2 68.4,8.2 68.8,7.8 69,7.8 69.1,7.7 IC4.12
SPI1_MOSI  (via drill 0.3)
  Top 0.2: IC1.41 50.66,8.4 51.4,8.4 52,9 62.2,9 63.2,8 66.8,8 v67.6,8.8 | IC4.13 70,7.2 v69.4,6.6
  Bottom 0.2: v69.4,6.6 67.8,6.6 67.4,7 67.4,7.4 67.8,7.8 67.8,8.6 v67.6,8.8
SPI1_SCK  (via drill 0.3)
  Top 0.2: IC1.39 51.27,7.6 51.8,7.6 52.4,8.2 61.8,8.2 62.8,7.2 67.2,7.2 67.8,7.8 68.2,7.8 v68.8,7.2 | IC4.11 69.4,8.2 v69.2,8.4
  Bottom 0.2: v68.8,7.2 68.8,8 v69.2,8.4
SPI2_MISO
  Top 0.2: IC1.27 48.89,1.6 49.8,1.6 51.2,3 54.6,3 55.4,2.2 56.8,2.2 57.8,3.2 57.8,3.8 58,4 60.6,4 60.8,3.8 60.8,2 61,1.8 64.8,1.8 65,2 65.36,2 IC2.2
SPI2_MOSI
  Top 0.2: IC1.28 49.2,2 49.6,2 51,3.4 54.8,3.4 55.6,2.6 56.6,2.6 57.4,3.4 57.4,4 58.1,4.71 IC2.5
SPI2_SCK
  Top 0.2: IC1.26 48.58,1.2 50,1.2 51.4,2.6 54.4,2.6 55.2,1.8 57,1.8 58.6,3.4 59.23,3.4 IC2.6
SWCLK  (via drill 0.3)
  Top 0.2: IC1.37 51.91,6 54,6 55.4,4.6 55.4,4 55.6,3.8 v56.8,3.8
  Bottom 0.2: SWCLK.TP 58.2,2.4 v56.8,3.8
SWDIO  (via drill 0.3)
  Top 0.2: IC1.34 51.24,4.2 53.8,4.2 54.2,4.6 54.8,4.6 55,4.4 55,3.8 55.6,3.2 v56,3.2
  Bottom 0.2: SWDIO.TP 55.6,2.8 v56,3.2
USB_VBUS  (via drill 0.3)
  Top 0.2: IC11.7 21.5,6.1 21.1,5.7 IC11.8 20.1,5.1 19.6,4.6 19.6,4.05 C67.1 19.4,3.8 18,2.4 18,2.2 L7.2 17.8,1.4 v17.6,1.2 | v5,0.6 3.25,0.6 D4.A
  Bottom 0.2: v17.6,1.2 17.2,0.8 15,0.8 13.8,2 13,2 12.4,1.4 12.4,0.8 12,0.4 5.2,0.4 v5,0.6
VBAT  (via drill 0.3, 1)
  Top 0.2: R9.2 12.35,0.95 11.8,0.4 6.2,0.4 5.2,1.4 5.2,1.65 C11.1 | v2.4,8 v0.8,8 0.8,6.8 PAD2.1 | v0.8,4 v2.4,4
  other vias: 1.6,6
  pour Top (no thermals): 2.6,7 4.6,7 5,6.6 5,6 3.8,6 3.6,5.8 3.6,4.6 3.8,4.4 5,4.4 5,3.4 5.4,3 5.4,1.4 5.2,1.2 3.8,1.2 2.6,2.4 2.6,3.6

### Text on the board
bNames: capsense-soil-sensor-1.0.0 | CC-BY-SA qyx@krtko.org